# EAGLE schematic 2Светофор (EAGLE 9.4.2)
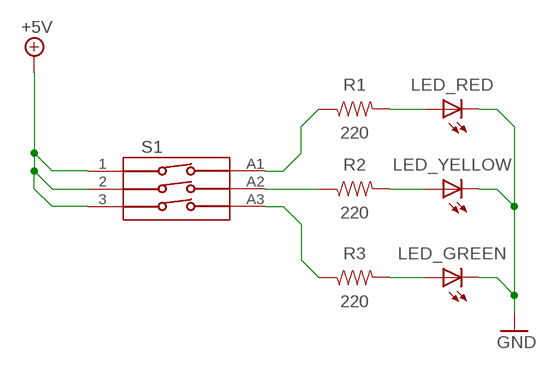
[diagram p0: schematic, sheet 1]

## Parts
LED_GREEN  LED5MM  [LED5MM]
LED_RED  LED5MM  [LED5MM]
LED_YELLOW  LED5MM  [LED5MM]
R1  220  100OHM-HORIZ-1/4W-1%  [AXIAL-0.3]
R2  220  100OHM-HORIZ-1/4W-1%  [AXIAL-0.3]
R3  220  100OHM-HORIZ-1/4W-1%  [AXIAL-0.3]
S1  418117170903  [418117170903]

## Nets
+5V: S1.1 S1.2 S1.3
GND: LED_GREEN.K(C) LED_RED.K(C) LED_YELLOW.K(C)
N$1: R2.P$1 S1.A2
N$4: R1.P$1 S1.A1
N$5: R3.P$1 S1.A3
N$8: LED_RED.A R1.P$2
N$9: LED_YELLOW.A R2.P$2
N$10: LED_GREEN.A R3.P$2

## Library data of the parts
LED_GREEN LED_RED LED_YELLOW = adafruit:LED: LED OSRAM: - CHIPLED LG R971, LG N971, LY N971, LG Q971, LY Q971, LO R971, LY R971 LH N974, LH R974 LS Q976, LO Q976, LY Q976 LO Q996 - Hyper CHIPLED LW Q18S LB Q993, LB Q99A, LB R99A - SideLED LS A670, LO A670, LY A670, LG A670, LP A670 LB A673, LV A673, LT A673, LW A673 LH A674 LY A675 LS A676, LA A676, LO A676, LY A676, LW A676 LS A679, LY A679, LG A679 - Hyper Micro SIDELED® LS Y876, LA Y876, LO Y876, LY Y876 LT Y87S - SmartLED LW L88C, LW L88S LB L89C, LB L89S, LG L890 LS L89K, LO L89K, LY L89K LS L896, LA L896, LO L896, LY L896 - TOPLED LS T670, LO T670, LY T670, LG T670, LP T670 LSG T670, LSP T670, LSY T670, LOP T670, LYG T670 LG T671, LOG T671, LSG T671 LB T673, LV T673, LT T673, LW T673 LH T674 LS T676, LA T676, LO T676, LY T676, LB T676, LH T676, LSB T676, LW T676 LB T67C, LV T67C, LT T67C, LS T67K, LO T67K, LY T67K, LW E67C LS E67B, LA E67B, LO E67B, LY E67B, LB E67C, LV E67C, LT E67C LW T67C LS T679, LY T679, LG T679 LS T770, LO T770, LY T770, LG T770, LP T770 LB T773, LV T773, LT T773, LW T773 LH T774 LS E675, LA E675, LY E675, LS T675 LS T776, LA T776, LO T776, LY T776, LB T776 LHGB T686 LT T68C, LB T68C - Hyper Mini TOPLED® LB M676 - Mini TOPLED Santana® LG M470 LS M47K, LO M47K, LY M47K Source: http://www.osram.convergy.de/
R1-R3 = SparkFun-Resistors:100OHM: 100Ω resistor A resistor is a passive two-terminal electrical component that implements electrical resistance as a circuit element. Resistors act to reduce current flow, and, at the same time, act to lower voltage levels within circuits. - Wikipedia; PROD_ID: RES-12181; VALUE: 100
S1 = Wurth_Elektronik_Electromechanic_Switch_rev18c:418117170903: 2.54 mm compact THT with flat actuator WS-DITV, 3 Pole <http://katalog.we-online.de/media/images/v2/Family_WS-DITV_4181171709xx.jpg> Details see: http://katalog.we-online.de/en/em/DITV_2_54_COMPACT_THT_WITH_FLAT_ACTUATOR 2015 (C) Wurth Elektronik